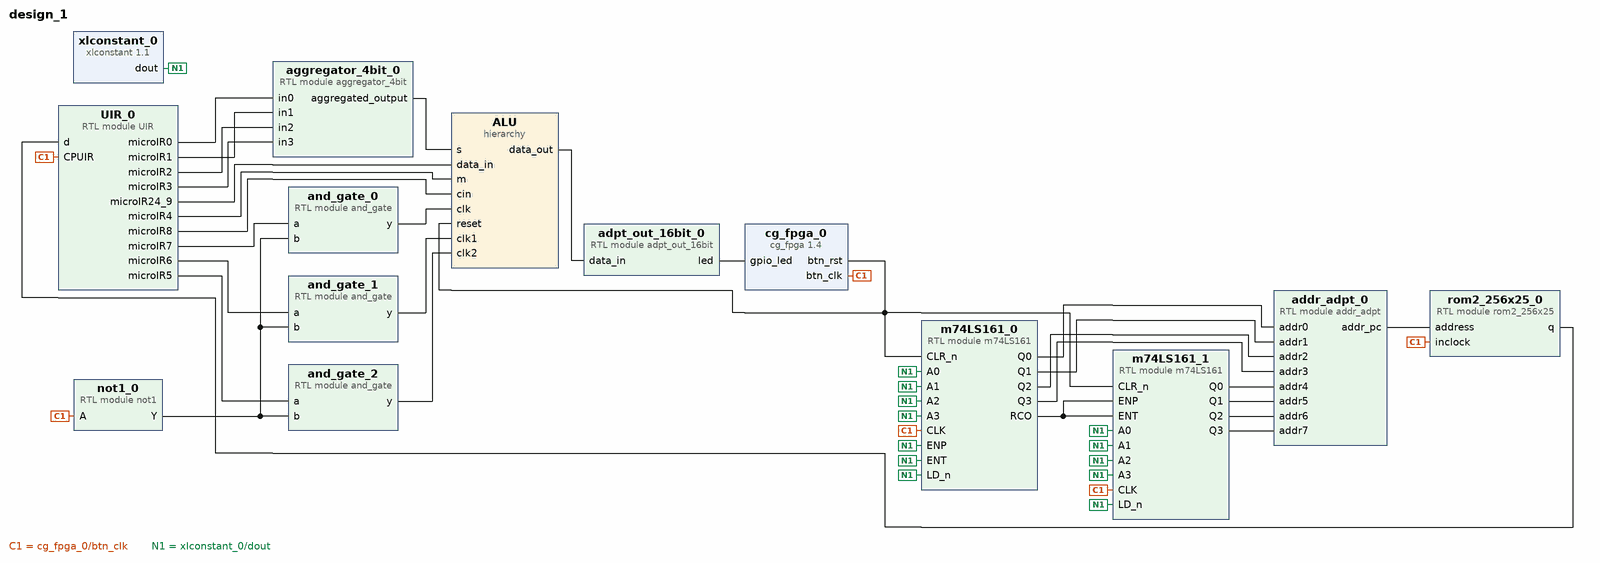
[diagram p0: block diagram of the top level]
# Vivado block design design_1, xc7z020clg400-1, Vivado 2024.2
create_bd_design design_1

create_bd_cell -type ip -vlnv educg.net:user:cg_fpga:1.4 cg_fpga_0
create_bd_cell -type ip -vlnv xilinx.com:ip:xlconstant:1.1 xlconstant_0
create_bd_cell -type module -reference m74LS161 m74LS161_0
create_bd_cell -type module -reference m74LS161 m74LS161_1
create_bd_cell -type module -reference UIR UIR_0
create_bd_cell -type module -reference rom2_256x25 rom2_256x25_0
create_bd_cell -type module -reference addr_adpt addr_adpt_0
create_bd_cell -type hier ALU
create_bd_cell -type module -reference aggregator_4bit aggregator_4bit_0
create_bd_cell -type module -reference and_gate and_gate_0
create_bd_cell -type module -reference and_gate and_gate_1
create_bd_cell -type module -reference and_gate and_gate_2
create_bd_cell -type module -reference not1 not1_0
create_bd_cell -type module -reference adpt_out_16bit adpt_out_16bit_0

# ---- hierarchy /ALU ----
current_bd_instance /ALU
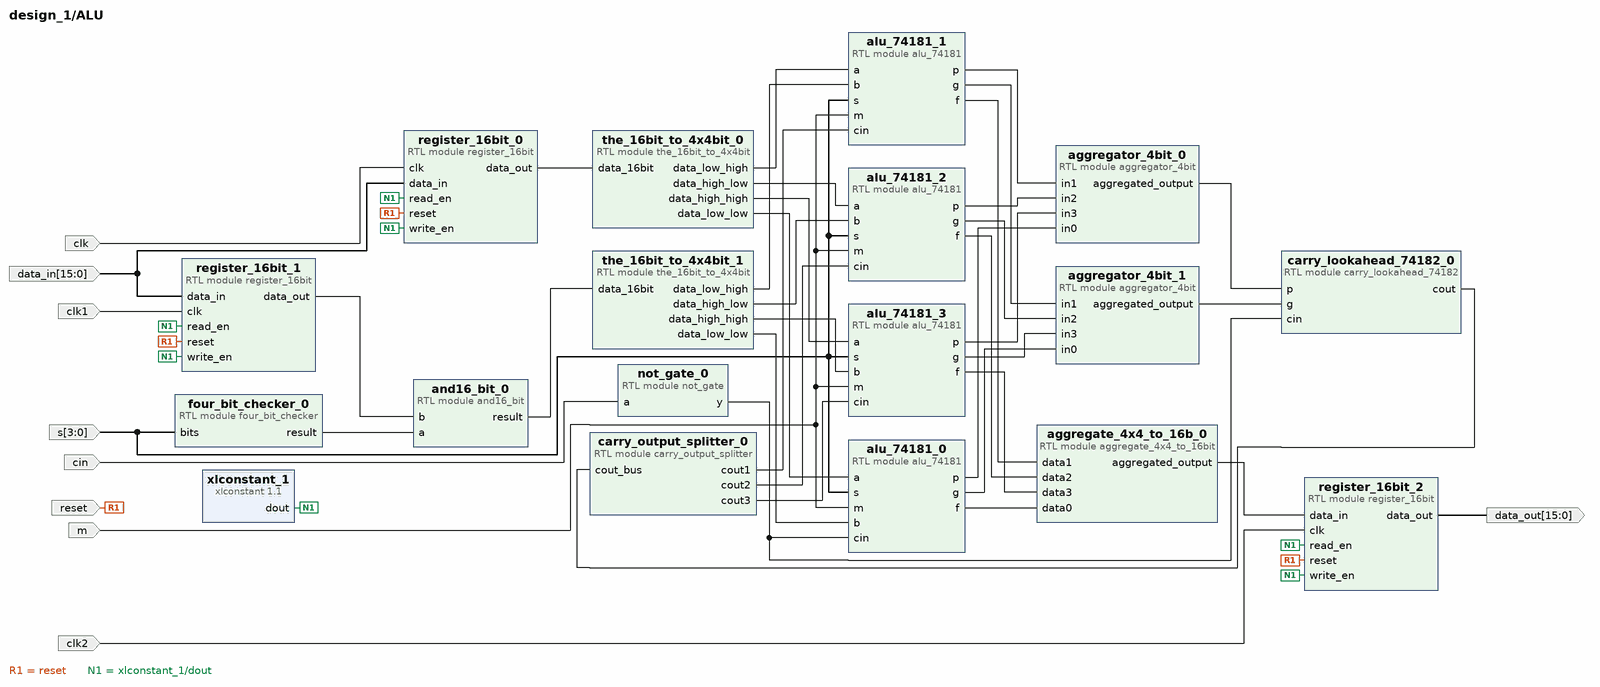
[diagram p1: block diagram inside /ALU]
create_bd_pin -dir I -from 3 -to 0 s
create_bd_pin -dir I m
create_bd_pin -dir I cin
create_bd_pin -dir I -from 15 -to 0 data_in
create_bd_pin -dir O -from 15 -to 0 data_out
create_bd_pin -dir I -type clk clk
create_bd_pin -dir I -type clk clk1
create_bd_pin -dir I -type clk clk2
create_bd_pin -dir I -type rst reset

create_bd_cell -type module -reference carry_lookahead_74182 carry_lookahead_74182_0
create_bd_cell -type module -reference carry_output_splitter carry_output_splitter_0
create_bd_cell -type module -reference alu_74181 alu_74181_0
create_bd_cell -type module -reference alu_74181 alu_74181_1
create_bd_cell -type module -reference alu_74181 alu_74181_2
create_bd_cell -type module -reference alu_74181 alu_74181_3
create_bd_cell -type module -reference aggregator_4bit aggregator_4bit_1
create_bd_cell -type module -reference register_16bit register_16bit_0
create_bd_cell -type module -reference the_16bit_to_4x4bit the_16bit_to_4x4bit_0
create_bd_cell -type module -reference register_16bit register_16bit_1
create_bd_cell -type module -reference the_16bit_to_4x4bit the_16bit_to_4x4bit_1
create_bd_cell -type module -reference register_16bit register_16bit_2
create_bd_cell -type ip -vlnv xilinx.com:ip:xlconstant:1.1 xlconstant_1
create_bd_cell -type module -reference not_gate not_gate_0
create_bd_cell -type module -reference four_bit_checker four_bit_checker_0
create_bd_cell -type module -reference and16_bit and16_bit_0
create_bd_cell -type module -reference aggregator_4bit aggregator_4bit_0
create_bd_cell -type module -reference aggregate_4x4_to_16bit aggregate_4x4_to_16b_0

# ---- connections ----

current_bd_instance /ALU
connect_bd_net [get_bd_pins aggregate_4x4_to_16b_0/aggregated_output] [get_bd_pins register_16bit_2/data_in]
connect_bd_net [get_bd_pins aggregator_4bit_0/aggregated_output] [get_bd_pins carry_lookahead_74182_0/p]
connect_bd_net [get_bd_pins aggregator_4bit_1/aggregated_output] [get_bd_pins carry_lookahead_74182_0/g]
connect_bd_net [get_bd_pins alu_74181_0/f] [get_bd_pins aggregate_4x4_to_16b_0/data0]
connect_bd_net [get_bd_pins alu_74181_0/g] [get_bd_pins aggregator_4bit_1/in0]
connect_bd_net [get_bd_pins alu_74181_0/p] [get_bd_pins aggregator_4bit_0/in0]
connect_bd_net [get_bd_pins alu_74181_1/f] [get_bd_pins aggregate_4x4_to_16b_0/data1]
connect_bd_net [get_bd_pins alu_74181_1/g] [get_bd_pins aggregator_4bit_1/in1]
connect_bd_net [get_bd_pins alu_74181_1/p] [get_bd_pins aggregator_4bit_0/in1]
connect_bd_net [get_bd_pins alu_74181_2/f] [get_bd_pins aggregate_4x4_to_16b_0/data2]
connect_bd_net [get_bd_pins alu_74181_2/g] [get_bd_pins aggregator_4bit_1/in2]
connect_bd_net [get_bd_pins alu_74181_2/p] [get_bd_pins aggregator_4bit_0/in2]
connect_bd_net [get_bd_pins alu_74181_3/f] [get_bd_pins aggregate_4x4_to_16b_0/data3]
connect_bd_net [get_bd_pins alu_74181_3/g] [get_bd_pins aggregator_4bit_1/in3]
connect_bd_net [get_bd_pins alu_74181_3/p] [get_bd_pins aggregator_4bit_0/in3]
connect_bd_net [get_bd_pins and16_bit_0/result] [get_bd_pins the_16bit_to_4x4bit_1/data_16bit]
connect_bd_net [get_bd_pins carry_lookahead_74182_0/cout] [get_bd_pins carry_output_splitter_0/cout_bus]
connect_bd_net [get_bd_pins carry_output_splitter_0/cout1] [get_bd_pins alu_74181_1/cin]
connect_bd_net [get_bd_pins carry_output_splitter_0/cout2] [get_bd_pins alu_74181_2/cin]
connect_bd_net [get_bd_pins carry_output_splitter_0/cout3] [get_bd_pins alu_74181_3/cin]
connect_bd_net -net cin_1 [get_bd_pins not_gate_0/y] [get_bd_pins carry_lookahead_74182_0/cin] [get_bd_pins alu_74181_0/cin]
connect_bd_net [get_bd_pins cin] [get_bd_pins not_gate_0/a]
connect_bd_net -net clk1_1 [get_bd_pins clk1] [get_bd_pins register_16bit_1/clk]
connect_bd_net -net clk2_1 [get_bd_pins clk2] [get_bd_pins register_16bit_2/clk]
connect_bd_net [get_bd_pins clk] [get_bd_pins register_16bit_0/clk]
connect_bd_net [get_bd_pins data_in] [get_bd_pins register_16bit_0/data_in] [get_bd_pins register_16bit_1/data_in]
connect_bd_net [get_bd_pins four_bit_checker_0/result] [get_bd_pins and16_bit_0/a]
connect_bd_net [get_bd_pins m] [get_bd_pins alu_74181_0/m] [get_bd_pins alu_74181_1/m] [get_bd_pins alu_74181_2/m] [get_bd_pins alu_74181_3/m]
connect_bd_net [get_bd_pins register_16bit_0/data_out] [get_bd_pins the_16bit_to_4x4bit_0/data_16bit]
connect_bd_net [get_bd_pins register_16bit_1/data_out] [get_bd_pins and16_bit_0/b]
connect_bd_net [get_bd_pins register_16bit_2/data_out] [get_bd_pins data_out]
connect_bd_net [get_bd_pins reset] [get_bd_pins register_16bit_2/reset] [get_bd_pins register_16bit_1/reset] [get_bd_pins register_16bit_0/reset]
connect_bd_net [get_bd_pins s] \
  [get_bd_pins alu_74181_0/s] [get_bd_pins alu_74181_1/s] [get_bd_pins alu_74181_2/s] [get_bd_pins alu_74181_3/s] \
  [get_bd_pins four_bit_checker_0/bits]
connect_bd_net [get_bd_pins the_16bit_to_4x4bit_0/data_high_high] [get_bd_pins alu_74181_3/a]
connect_bd_net [get_bd_pins the_16bit_to_4x4bit_0/data_high_low] [get_bd_pins alu_74181_2/a]
connect_bd_net [get_bd_pins the_16bit_to_4x4bit_0/data_low_high] [get_bd_pins alu_74181_1/a]
connect_bd_net [get_bd_pins the_16bit_to_4x4bit_0/data_low_low] [get_bd_pins alu_74181_0/a]
connect_bd_net [get_bd_pins the_16bit_to_4x4bit_1/data_high_high] [get_bd_pins alu_74181_3/b]
connect_bd_net [get_bd_pins the_16bit_to_4x4bit_1/data_high_low] [get_bd_pins alu_74181_2/b]
connect_bd_net [get_bd_pins the_16bit_to_4x4bit_1/data_low_high] [get_bd_pins alu_74181_1/b]
connect_bd_net [get_bd_pins the_16bit_to_4x4bit_1/data_low_low] [get_bd_pins alu_74181_0/b]
connect_bd_net [get_bd_pins xlconstant_1/dout] \
  [get_bd_pins register_16bit_2/write_en] [get_bd_pins register_16bit_2/read_en] [get_bd_pins register_16bit_1/write_en] \
  [get_bd_pins register_16bit_1/read_en] [get_bd_pins register_16bit_0/write_en] [get_bd_pins register_16bit_0/read_en]

current_bd_instance /
connect_bd_net [get_bd_pins ALU/data_out] [get_bd_pins adpt_out_16bit_0/data_in]
connect_bd_net [get_bd_pins UIR_0/microIR0] [get_bd_pins aggregator_4bit_0/in0]
connect_bd_net [get_bd_pins UIR_0/microIR1] [get_bd_pins aggregator_4bit_0/in1]
connect_bd_net [get_bd_pins UIR_0/microIR2] [get_bd_pins aggregator_4bit_0/in2]
connect_bd_net [get_bd_pins UIR_0/microIR24_9] [get_bd_pins ALU/data_in]
connect_bd_net [get_bd_pins UIR_0/microIR3] [get_bd_pins aggregator_4bit_0/in3]
connect_bd_net [get_bd_pins UIR_0/microIR4] [get_bd_pins ALU/m]
connect_bd_net [get_bd_pins UIR_0/microIR5] [get_bd_pins and_gate_2/a]
connect_bd_net [get_bd_pins UIR_0/microIR6] [get_bd_pins and_gate_1/a]
connect_bd_net [get_bd_pins UIR_0/microIR7] [get_bd_pins and_gate_0/a]
connect_bd_net [get_bd_pins UIR_0/microIR8] [get_bd_pins ALU/cin]
connect_bd_net [get_bd_pins addr_adpt_0/addr_pc] [get_bd_pins rom2_256x25_0/address]
connect_bd_net [get_bd_pins adpt_out_16bit_0/led] [get_bd_pins cg_fpga_0/gpio_led]
connect_bd_net [get_bd_pins aggregator_4bit_0/aggregated_output] [get_bd_pins ALU/s]
connect_bd_net [get_bd_pins and_gate_0/y] [get_bd_pins ALU/clk]
connect_bd_net [get_bd_pins and_gate_1/y] [get_bd_pins ALU/clk1]
connect_bd_net [get_bd_pins and_gate_2/y] [get_bd_pins ALU/clk2]
connect_bd_net [get_bd_pins cg_fpga_0/btn_clk] \
  [get_bd_pins UIR_0/CPUIR] [get_bd_pins m74LS161_0/CLK] [get_bd_pins m74LS161_1/CLK] [get_bd_pins not1_0/A] \
  [get_bd_pins rom2_256x25_0/inclock]
connect_bd_net [get_bd_pins cg_fpga_0/btn_rst] [get_bd_pins ALU/reset] [get_bd_pins m74LS161_0/CLR_n] [get_bd_pins m74LS161_1/CLR_n]
connect_bd_net [get_bd_pins m74LS161_0/Q0] [get_bd_pins addr_adpt_0/addr0]
connect_bd_net [get_bd_pins m74LS161_0/Q1] [get_bd_pins addr_adpt_0/addr1]
connect_bd_net [get_bd_pins m74LS161_0/Q2] [get_bd_pins addr_adpt_0/addr2]
connect_bd_net [get_bd_pins m74LS161_0/Q3] [get_bd_pins addr_adpt_0/addr3]
connect_bd_net [get_bd_pins m74LS161_0/RCO] [get_bd_pins m74LS161_1/ENP] [get_bd_pins m74LS161_1/ENT]
connect_bd_net [get_bd_pins m74LS161_1/Q0] [get_bd_pins addr_adpt_0/addr4]
connect_bd_net [get_bd_pins m74LS161_1/Q1] [get_bd_pins addr_adpt_0/addr5]
connect_bd_net [get_bd_pins m74LS161_1/Q2] [get_bd_pins addr_adpt_0/addr6]
connect_bd_net [get_bd_pins m74LS161_1/Q3] [get_bd_pins addr_adpt_0/addr7]
connect_bd_net [get_bd_pins not1_0/Y] [get_bd_pins and_gate_0/b] [get_bd_pins and_gate_1/b] [get_bd_pins and_gate_2/b]
connect_bd_net [get_bd_pins rom2_256x25_0/q] [get_bd_pins UIR_0/d]
connect_bd_net [get_bd_pins xlconstant_0/dout] \
  [get_bd_pins m74LS161_0/ENP] [get_bd_pins m74LS161_0/ENT] [get_bd_pins m74LS161_0/LD_n] [get_bd_pins m74LS161_0/A3] \
  [get_bd_pins m74LS161_0/A2] [get_bd_pins m74LS161_0/A1] [get_bd_pins m74LS161_0/A0] [get_bd_pins m74LS161_1/LD_n] \
  [get_bd_pins m74LS161_1/A3] [get_bd_pins m74LS161_1/A2] [get_bd_pins m74LS161_1/A1] [get_bd_pins m74LS161_1/A0]

validate_bd_design
save_bd_design
